# Altium schematic sheet Connecteur SIM7000G devbord .SchDoc
size A4; SheetNumber: 7; SheetTotal: 7
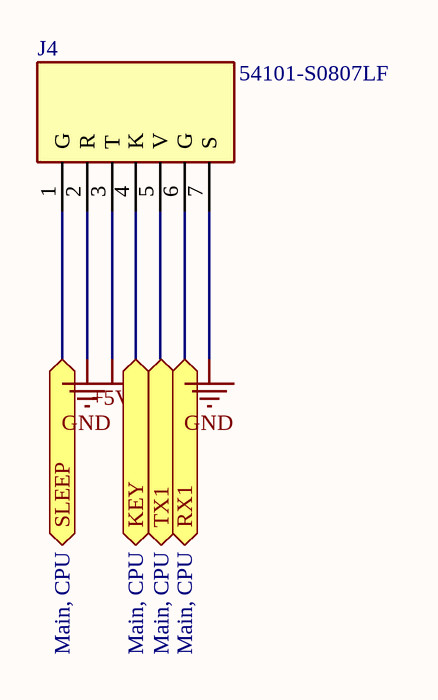
[diagram p0: Connecteur SIM7000G devbord .SchDoc]

## Parts
J4  54101-S0807LF  [54101S0807LF]

## Ports
KEY (bidir, see Main, CPU), RX1 (bidir, see Main, CPU), SLEEP (bidir, see Main, CPU), TX1 (bidir, see Main, CPU)

## Nets
+5V: J4.3(T)
GND: J4.2(R) J4.7(S)
KEY: J4.4(K) ; port KEY
RX1: J4.6(G) ; port RX1
SLEEP: J4.1(G) ; port SLEEP
TX1: J4.5(V) ; port TX1

## Library data of the parts
J4 = SIM7000G CONNETEUR: BergStik, Board to Board connector, Unshrouded vertical Header, Through Hole, Single Row, 6 Positions, 2.54 mm Pitch.; Manufacturer_Name: Amphenol Communication Solutions; Geometry.Height: 8.58mm; Mouser Part Number: 649-54101-S0807LF; Mouser Price/Stock: https://www.mouser.co.uk/ProductDetail/Amphenol-FCI/54101-S0803LF?qs=iiM6sTJtPEc921tw16XaKg%3D%3D; Manufacturer_Part_Number: 54101-S0807LF; Datasheet Link: https://cdn.amphenol-cs.com/media/wysiwyg/files/drawing/54101.pdf